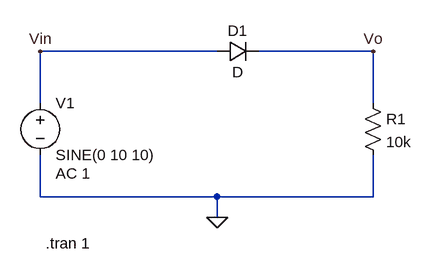
[diagram p0: schematic HalfWaveRectifier.asc]
HalfWaveRectifier.asc, the LTspice schematic file:
Version 4
SHEET 1 880 680
WIRE 304 64 32 64
WIRE 544 64 368 64
WIRE 32 144 32 64
WIRE 544 144 544 64
WIRE 32 288 32 224
WIRE 304 288 32 288
WIRE 544 288 544 224
WIRE 544 288 304 288
WIRE 304 320 304 288
FLAG 304 320 0
FLAG 32 64 Vin
FLAG 544 64 Vo
SYMBOL voltage 32 128 R0
WINDOW 123 24 124 Left 2
WINDOW 39 0 0 Left 0
SYMATTR InstName V1
SYMATTR Value SINE(0 10 10)
SYMATTR Value2 AC 1
SYMBOL diode 304 80 R270
WINDOW 0 32 32 VTop 2
WINDOW 3 0 32 VBottom 2
SYMATTR InstName D1
SYMBOL res 528 128 R0
SYMATTR InstName R1
SYMATTR Value 10k
TEXT 40 360 Left 2 !.tran 1

The netlist it stands for:
* HalfWaveRectifier.asc
V1 Vin 0 SINE(0 10 10) AC 1
D1 Vin Vo D
R1 Vo 0 10k
.model D D
.lib standard.dio
.tran 1
.backanno
.end

* Results of the author's LTspice run, read from the files saved beside the schematic
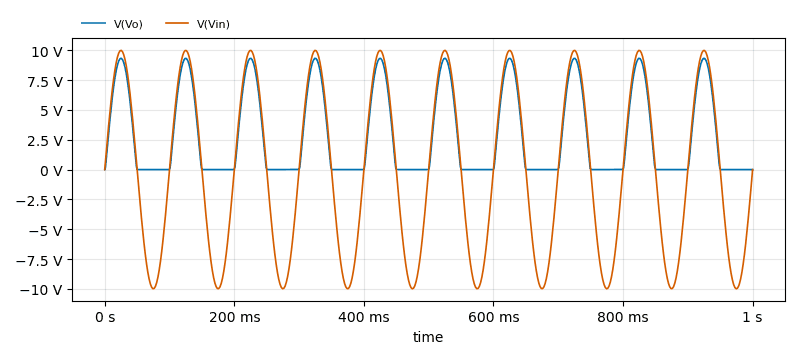
[diagram p1: Transient Analysis of HalfWaveRectifier.asc, plotted from the saved traces]
* Transient Analysis, 1 run:
*   V(Vo): min 0 V, max 9.333 V, average 2.869 V, rms 4.588 V, last 0 V
*   V(Vin): min -9.998 V, max 9.996 V, average 20.06 µV, rms 7.07 V, last 0 V